# Altium schematic sheet LCD Display.SchDoc
size A4; SheetNumber: 3; SheetTotal: 4
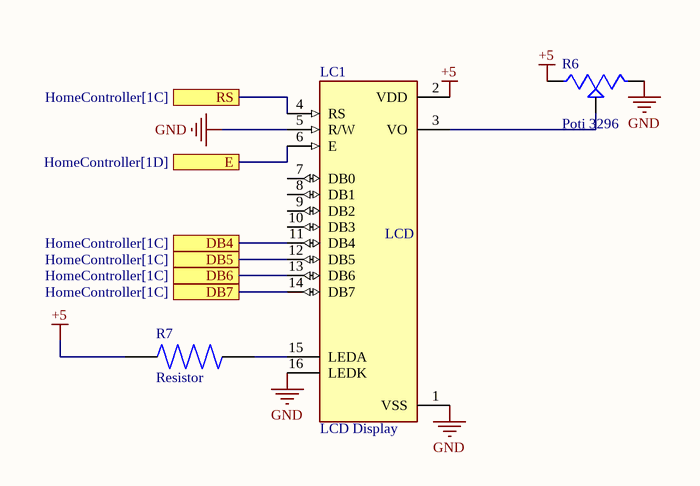
[diagram p0: LCD Display.SchDoc]

## Parts
LC1  LCD Display  [LCD Display-Footprint-1]
R6  Poti 3296  [Poti 3296-Footprint-1]
R7  Resistor  [Resistor-Footprint-1]

## Ports
DB4 (see HomeController[1C]), DB5 (see HomeController[1C]), DB6 (see HomeController[1C]), DB7 (see HomeController[1C]), E (see HomeController[1D]), RS (see HomeController[1C])

## Nets
+5: LC1.2(VDD) R6.1(CCW) R7.1
GND: LC1.1(VSS) LC1.5(R/W) LC1.16(LEDK) R6.3(CW)
DB4: LC1.11(DB4) ; port DB4
DB5: LC1.12(DB5) ; port DB5
DB6: LC1.13(DB6) ; port DB6
DB7: LC1.14(DB7) ; port DB7
E: LC1.6(E) ; port E
RS: LC1.4(RS) ; port RS
NetLC1_3: LC1.3(VO) R6.2(WIPER)
NetLC1_15: LC1.15(LEDA) R7.2

Not connected (* = marked no-connect by the designer): LC1 7(DB0) 8(DB1) 9(DB2) 10(DB3)

## Notes on the sheet
- (in symbol CMP-00030-2) LCD

## Library data of the parts
LC1 = CMP-00030-2: 16x2 LCD Display
R6 = CMP-00013-1: Generic Potentiometer
R7 = CMP-00014-2: Generic Resistor